# Altium project MAR_modems_board_A1.PrjPcb (part 2 of 2)

## Sheet USB2514_hubs_1.SchDoc
size A3
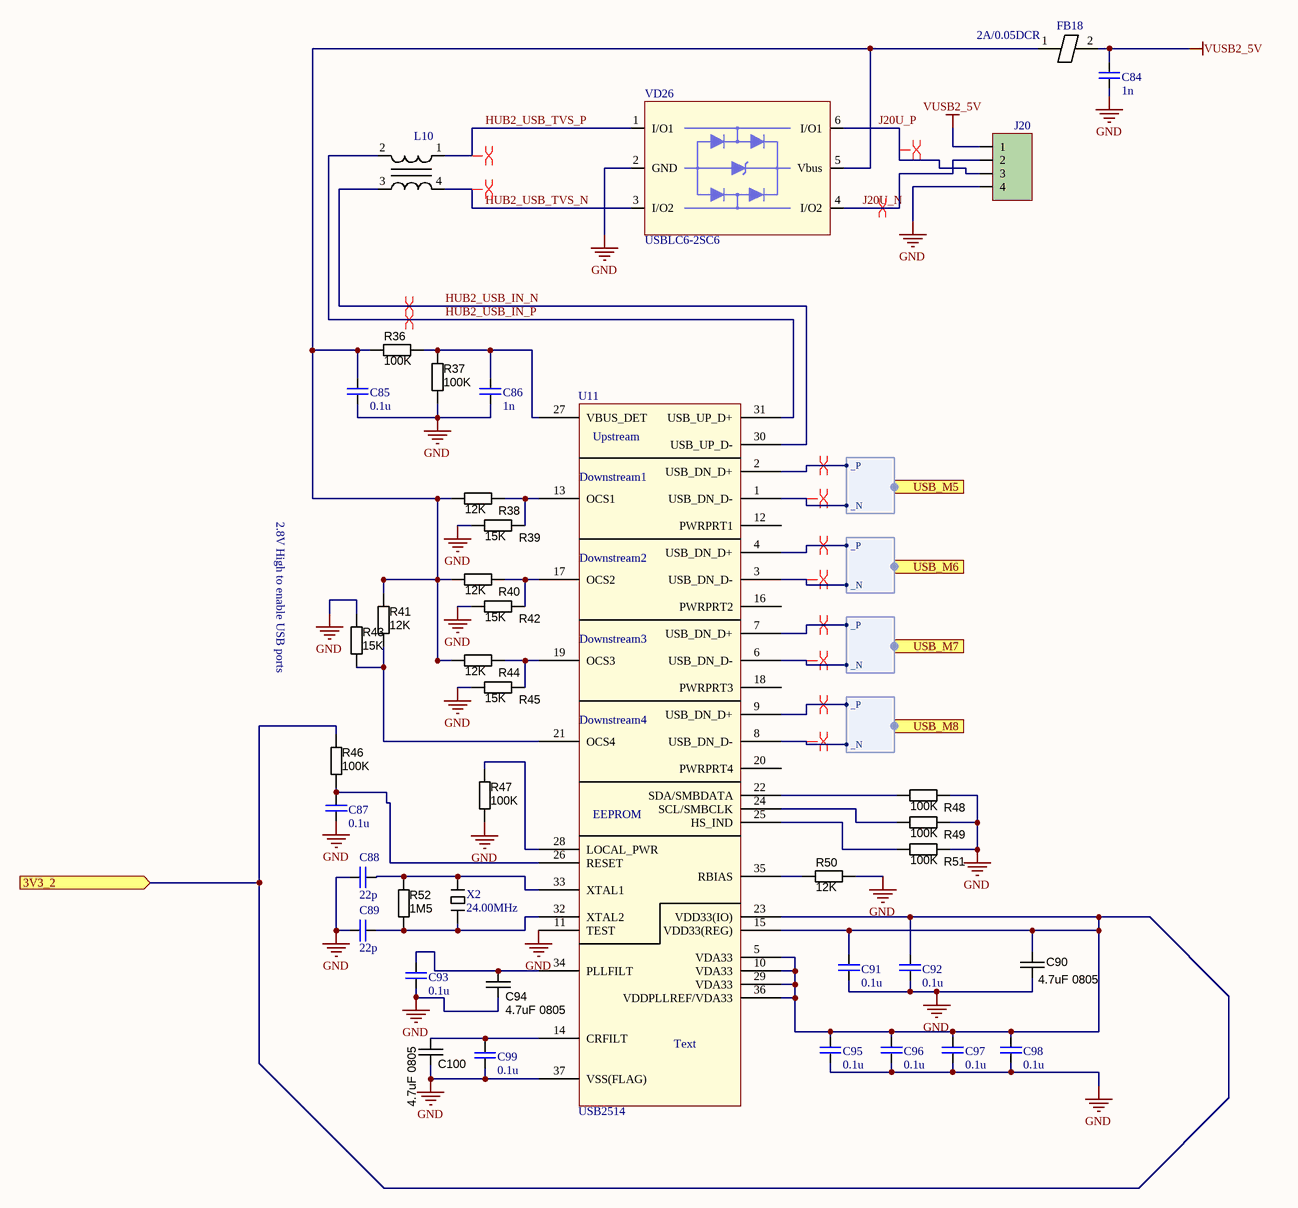
[diagram p6: USB2514_hubs_1.SchDoc]

### Parts
C84  value 1n  [C0402]  (hidden comment: Конденсатор SMD, 1нФ, X7R, 25В, 10%, 0402)
C85  value 0.1u  [C0402]  (hidden comment: Конденсатор SMD, 0.1мкФ, X7R, 25В, 10%, 0402)
C86  value 1n  [C0402]  (hidden comment: Конденсатор SMD, 1нФ, X7R, 25В, 10%, 0402)
C87  value 0.1u  [C0402]  (hidden comment: Конденсатор SMD, 0.1мкФ, X7R, 25В, 10%, 0402)
C88  value 22p  [C0402]  (hidden comment: Конденсатор SMD, 22пФ, X7R, 50В, 10%, 0402)
C89  value 22p  [C0402]  (hidden comment: Конденсатор SMD, 22пФ, X7R, 50В, 10%, 0402)
C90  value 4.7uF 0805  [CAPC2012X135N]  (hidden comment: approved sub OK)
C91  value 0.1u  [C0402]  (hidden comment: Конденсатор SMD, 0.1мкФ, X7R, 25В, 10%, 0402)
C92  value 0.1u  [C0402]  (hidden comment: Конденсатор SMD, 0.1мкФ, X7R, 25В, 10%, 0402)
C93  value 0.1u  [C0402]  (hidden comment: Конденсатор SMD, 0.1мкФ, X7R, 25В, 10%, 0402)
C94  value 4.7uF 0805  [CAPC2012X135N]  (hidden comment: approved sub OK)
C95  value 0.1u  [C0402]  (hidden comment: Конденсатор SMD, 0.1мкФ, X7R, 25В, 10%, 0402)
C96  value 0.1u  [C0402]  (hidden comment: Конденсатор SMD, 0.1мкФ, X7R, 25В, 10%, 0402)
C97  value 0.1u  [C0402]  (hidden comment: Конденсатор SMD, 0.1мкФ, X7R, 25В, 10%, 0402)
C98  value 0.1u  [C0402]  (hidden comment: Конденсатор SMD, 0.1мкФ, X7R, 25В, 10%, 0402)
C99  value 0.1u  [C0402]  (hidden comment: Конденсатор SMD, 0.1мкФ, X7R, 25В, 10%, 0402)
C100  value 4.7uF 0805  [CAPC2012X135N]  (hidden comment: approved sub OK)
FB18  2A/0.05DCR  [RESC2012X70N]
J20  Разъём (вилка), CWF-4 (DS1069-4 M)  [CWF-4]  (value not drawn)
L10  Inductor ESD (Choke)  [EMI Choke Murata]  (value not drawn)
R36  value 100K  [RESC1005X40N]  (hidden comment: Thick Film)
R37  value 100K  [RESC1005X40N]  (hidden comment: Thick Film)
R38  value 12K  [RESC1005X40N]  (hidden comment: Thick Film)
R39  value 15K  [RESC1005X40N]  (hidden comment: Thick Film)
R40  value 12K  [RESC1005X40N]  (hidden comment: Thick Film)
R41  value 12K  [RESC1005X40N]  (hidden comment: Thick Film)
R42  value 15K  [RESC1005X40N]  (hidden comment: Thick Film)
R43  value 15K  [RESC1005X40N]  (hidden comment: Thick Film)
R44  value 12K  [RESC1005X40N]  (hidden comment: Thick Film)
R45  value 15K  [RESC1005X40N]  (hidden comment: Thick Film)
R46  value 100K  [RESC1005X40N]  (hidden comment: Thick Film)
R47  value 100K  [RESC1005X40N]  (hidden comment: Thick Film)
R48  value 100K  [RESC1005X40N]  (hidden comment: Thick Film)
R49  value 100K  [RESC1005X40N]  (hidden comment: Thick Film)
R50  value 12K  [RESC1005X40N]  (hidden comment: Thick Film)
R51  value 100K  [RESC1005X40N]  (hidden comment: Thick Film)
R52  value 1M5  [RESC1005X40N]  (hidden comment: Thick Film)
U11  USB2514  [USB-2514B 4port Hub]
VD26  TVS Diode  [SOT23-6L]  (value not drawn)
X2  24.00MHz  [Quartz SMD KX-K]

### Ports
3V3_2 (in), USB_M5 (harness DIFF), USB_M6 (harness DIFF), USB_M7 (harness DIFF), USB_M8 (harness DIFF)

### Harnesses
DIFF: _P, _N

### Nets
GND: C84.2 C85.2 C86.2 C87.2 C88.1 C89.1 C90.2 C91.2 C92.2 C93.2 C94.2 C95.2 C96.2 C97.2 C98.2 C99.2 C100.2 J20.4 R37.2 R39.1 R42.1 R43.1 R45.1 R47.2 R48.2 R49.2 R50.2 R51.2 U11.11(TEST) U11.37(VSS(FLAG)) VD26.2(GND)
VUSB2_5V: C84.1 FB18.2 J20.1
3V3_2: C90.1 C91.1 C92.1 C95.1 C96.1 C97.1 C98.1 R46.1 U11.5(VDA33) U11.10(VDA33) U11.15(VDD33(REG)) U11.23(VDD33(IO)) U11.29(VDA33) U11.36(VDDPLLREF/VDA33) ; port 3V3_2
HUB2_USB_IN_N: L10.3 U11.30(USB_UP_D-)
HUB2_USB_IN_P: L10.2 U11.31(USB_UP_D+)
HUB2_USB_TVS_N: L10.4 VD26.3(I/O2)
HUB2_USB_TVS_P: L10.1 VD26.1(I/O1)
J20U_N: J20.2 VD26.4(I/O2)
J20U_P: J20.3 VD26.6(I/O1)
USB_M5._N: U11.1(USB_DN_D-) ; port USB_M5._N
USB_M5._P: U11.2(USB_DN_D+) ; port USB_M5._P
USB_M6._N: U11.3(USB_DN_D-) ; port USB_M6._N
USB_M6._P: U11.4(USB_DN_D+) ; port USB_M6._P
USB_M7._N: U11.6(USB_DN_D-) ; port USB_M7._N
USB_M7._P: U11.7(USB_DN_D+) ; port USB_M7._P
USB_M8._N: U11.8(USB_DN_D-) ; port USB_M8._N
USB_M8._P: U11.9(USB_DN_D+) ; port USB_M8._P
NetC85_1: C85.1 FB18.1 R36.1 R38.1 R40.1 R41.1 R44.1 VD26.5(Vbus)
NetC86_1: C86.1 R36.2 R37.1 U11.27(VBUS_DET)
NetC87_1: C87.1 R46.2 U11.26(RESET)
NetC88_2: C88.2 R52.1 U11.33(XTAL1) X2.2
NetC89_2: C89.2 R52.2 U11.32(XTAL2) X2.1
NetC93_1: C93.1 C94.1 U11.34(PLLFILT)
NetC99_1: C99.1 C100.1 U11.14(CRFILT)
NetR38_2: R38.2 R39.2 U11.13(OCS1)
NetR40_2: R40.2 R42.2 U11.17(OCS2)
NetR41_2: R41.2 R43.2 U11.21(OCS4)
NetR44_2: R44.2 R45.2 U11.19(OCS3)
NetR47_1: R47.1 U11.28(LOCAL_PWR)
NetR48_1: R48.1 U11.22(SDA/SMBDATA)
NetR49_1: R49.1 U11.24(SCL/SMBCLK)
NetR50_1: R50.1 U11.35(RBIAS)
NetR51_1: R51.1 U11.25(HS_IND)

Not connected (* = marked no-connect by the designer): U11 12(PWRPRT1) 16(PWRPRT2) 18(PWRPRT3) 20(PWRPRT4)

### Layout directives
differential pair: HUB2_USB_IN_N, HUB2_USB_IN_P, HUB2_USB_TVS_N, HUB2_USB_TVS_P, J20U_N, J20U_P, USB_M5._N, USB_M5._P, USB_M6._N, USB_M6._P, USB_M7._N, USB_M7._P, USB_M8._N, USB_M8._P

### Notes on the sheet
- 2.8V High to enable USB ports
- (in symbol SMSC USB2514) Upstream; Downstream1; Downstream2; Downstream3; Downstream4; EEPROM; Text

### Library data of the parts
C84 C86 = C0402: Chip Capacitor 0402; Assembly: 1n_X7R_25V_10%_0402; Voltage_assembly: 25V; Tolerance: 10%; Voltage: 25В; TemperatureCoeff: X7R; Family: Конденсатор SMD; Capacitance: 1нФ; Package: 0402
C85 C87 C91-C93 C95-C99 = C0402: Chip Capacitor 0402; Assembly: 0.1u_X7R_25V_10%_0402; Voltage_assembly: 25V; Tolerance: 10%; Voltage: 25В; TemperatureCoeff: X7R; Family: Конденсатор SMD; Capacitance: 0.1мкФ; Package: 0402
C88 C89 = C0402: Chip Capacitor 0402; Assembly: 22p_X7R_50V_10%_0402; Voltage_assembly: 50V; Tolerance: 10%; Voltage: 50В; TemperatureCoeff: X7R; Family: Конденсатор SMD; Capacitance: 22пФ; Package: 0402
C90 C94 C100 = CAPC_4u7_0805: Capacitor SMD Cer 4.7uF 10% 16V X5R 0805; Manufacturer 1: Taiyo Yuden; Manufacturer Part Number 1: EMK212BJ475KG-T; Ratings: 16V; X5R; Material: ceramic; SCDType: spec; Package / Case: 0805 (2012 Metric); Tolerance: ±10%; Supplier 1: Digi-Key; Supplier Part Number 1: 587-1294-1-ND; Operating Temperature: -55°C ~ 85°C; Size / Dimension: 0.079" L x 0.049" W (2.00mm x 1.25mm); Thickness (Max): 0.053" (1.35mm); ComponentLink1URL: http://www.yuden.co.jp/productdata/catalog/en/mlcc01_e.pdf; ComponentLink1Description: http://www.yuden.co.jp/productdata/catalog/en/mlcc01_e.pdf; Supplier 2: Digi-Key; Supplier Part Number 2: 1276-1065-1-ND; Manufacturer 2: Samsung Electro-Mechanics America, Inc; Manufacturer Part Number 2: CL21A475KOFNNNE; RoHS 2: RoHS Compliant; ComponentLink2URL: http://www.samsungsem.com/servlet/FileDownload?type=spec&file=CL21A475KOFNNNE.pdf; ComponentLink2Description: http://www.samsungsem.com/servlet/FileDownload?type=spec&file=CL21A475KOFNNNE.pdf; Supplier 3: Digi-Key; Supplier Part Number 3: 399-8101-1-ND; Manufacturer 3: Kemet; Manufacturer Part Number 3: C0805C475K4PACTU; RoHS 3: RoHS Compliant; ComponentLink3URL: http://capacitoredge.kemet.com/capedge2/DataSheet?pn=C0805C475K4PACTU; ComponentLink3Description: http://capacitoredge.kemet.com/capedge2/DataSheet?pn=C0805C475K4PACTU; Supplier 4: Digi-Key; Supplier Part Number 4: 490-7215-1-ND; Manufacturer 4: Murata Electronics North America; Manufacturer Part Number 4: GRM21BR61C475MA88L; RoHS 4: RoHS Compliant; ComponentLink4URL: http://psearch.murata.com/capacitor/product/GRM21BR61C475MA88#.pdf; ComponentLink4Description: http://psearch.murata.com/capacitor/product/GRM21BR61C475MA88#.pdf; Supplier 5: Digi-Key; Supplier Part Number 5: 445-7640-1-ND; Manufacturer 5: TDK Corporation; Manufacturer Part Number 5: C2012X5R1C475K125AC; RoHS 5: RoHS Compliant; ComponentLink5URL: http://product.tdk.com/capacitor/mlcc/en/documents/mlcc_commercial_general_en.pdf; ComponentLink5Description: http://product.tdk.com/capacitor/mlcc/en/documents/mlcc_commercial_general_en.pdf; RoHS 1: RoHS Compliant
FB18 = Ferrite Bead 2A/0.05DCR
J20 = CWF-4: 4-pin male though-hole connector, pitch 2.5 mm; Manufacturer: Confly (China); Family: Разъём (вилка); PartNumber: CWF-4 (DS1069-4 M); Assembly: CWF-4; Value: CWF-4
L10 = Inductor ESD (Choke): DLW21HN900SQ2L
R36 R37 R46 R47 = RES_100K_0402_5%: Resistor SMD chip 100k Ohm 0.063W 5% 0402; Manufacturer 1: Vishay Dale; Manufacturer Part Number 1: CRCW0402100KJNED; Ratings: 1/16 W; SCDType: undef; Package / Case: 0402 (1005 Metric); Tolerance: ±5%; ComponentLink2URL: http://www.yageo.com/documents/recent/PYu-RC0402_51_RoHS_L_6.pdf; ComponentLink2Description: http://www.yageo.com/documents/recent/PYu-RC0402_51_RoHS_L_6.pdf; Supplier 1: Digi-Key; Supplier Part Number 1: 541-100KJCT-ND; ComponentLink1URL: http://www.vishay.com/doc?20035; ComponentLink1Description: http://www.vishay.com/doc?20035; Supplier 2: Digi-Key; Supplier Part Number 2: 311-100KJRCT-ND; Manufacturer 2: Yageo; Manufacturer Part Number 2: RC0402JR-07100KL
R38-R45 R48-R51 = RES_1K_0402_5%: Resistor SMD chip 1k Ohm 0.063W 5% 0402; Manufacturer 1: Yageo; Manufacturer Part Number 1: RC0402JR-071KL; Ratings: 1/16 W; SCDType: spec; Package / Case: 0402 (1005 Metric); Tolerance: ±5%; Supplier 1: Digi-Key; Supplier Part Number 1: 311-1.0KJRCT-ND; RoHS 1: RoHS Compliant; ComponentLink1URL: http://www.yageo.com/documents/recent/PYu-RC0402_51_RoHS_L_6.pdf; ComponentLink1Description: http://www.yageo.com/documents/recent/PYu-RC0402_51_RoHS_L_6.pdf; Supplier 2: Digi-Key; Supplier Part Number 2: 541-1.0KJCT-ND; Manufacturer 2: Vishay Dale; Manufacturer Part Number 2: CRCW04021K00JNED; RoHS 2: RoHS Compliant; ComponentLink2URL: http://www.vishay.com/doc?20035; ComponentLink2Description: http://www.vishay.com/doc?20035; Supplier 3: Digi-Key; Supplier Part Number 3: 1276-4376-1-ND; Manufacturer 3: Samsung Electro-Mechanics America, Inc; Manufacturer Part Number 3: RC1005J102CS; RoHS 3: RoHS Compliant; ComponentLink3URL: http://www.samsungsem.com/servlet/FileDownload?filename=productcatalog/pdf/Chip_Resistor.pdf; ComponentLink3Description: http://www.samsungsem.com/servlet/FileDownload?filename=productcatalog/pdf/Chip_Resistor.pdf; Supplier 4: Digi-Key; Supplier Part Number 4: RHM1.0KCECT-ND; Manufacturer 4: Rohm Semiconductor; Manufacturer Part Number 4: MCR01MRTJ102; RoHS 4: RoHS Compliant; ComponentLink4URL: http://rohmfs.rohm.com/en/products/databook/datasheet/passive/resistor/chip_resistor/mcr_g.pdf; ComponentLink4Description: http://rohmfs.rohm.com/en/products/databook/datasheet/passive/resistor/chip_resistor/mcr_g.pdf; Supplier 5: Digi-Key; Supplier Part Number 5: P1.0KJCT-ND; Manufacturer 5: Panasonic Electronic Components; Manufacturer Part Number 5: ERJ-2GEJ102X; RoHS 5: RoHS Compliant; ComponentLink5URL: http://industrial.panasonic.com/www-cgi/jvcr13pz.cgi?E+PZ+3+AOA0001+ERJ2GEJ102X+7+WW; ComponentLink5Description: http://industrial.panasonic.com/www-cgi/jvcr13pz.cgi?E+PZ+3+AOA0001+ERJ2GEJ102X+7+WW
R52 = RES_1M_0402_5%: Resistor SMD chip 1M Ohm 0.063W 5% 0402; Manufacturer 1: Vishay Dale; Manufacturer Part Number 1: CRCW04021M00JNED; Ratings: 1/16 W; Power Rating: 0.063W, 1/16W; SCDType: spec; Package / Case: 0402 (1005 Metric); Tolerance: ±5%; Material: Thick Film; Manufacturer 2: Yageo; Manufacturer Part Number 2: RC0402JR-071ML; Supplier 1: Digi-Key; Supplier Part Number 1: 541-1.0MJCT-ND; ComponentLink1URL: http://www.vishay.com/doc?20035; ComponentLink1Description: http://www.vishay.com/doc?20035; Supplier 2: Digi-Key; Supplier Part Number 2: 311-1.0MJRCT-ND; ComponentLink2URL: http://www.yageo.com/documents/recent/PYu-RC0402_51_RoHS_L_6.pdf; ComponentLink2Description: http://www.yageo.com/documents/recent/PYu-RC0402_51_RoHS_L_6.pdf
U11 = SMSC USB2514: type: USB2514
VD26 = USBLC6-2SC6: Very low capacitance ESD protection; Manufacturer: STMicroelectronics; Part Number: USBLC6-2SC6
X2 = Quartz: Quartz KX-K

## Sheet 12Vin_to_3V3_LDO.SchDoc
size A4
Used 2 times, as channels 1, 2. Parts and nets are listed once, with the designators drawn on the sheet.
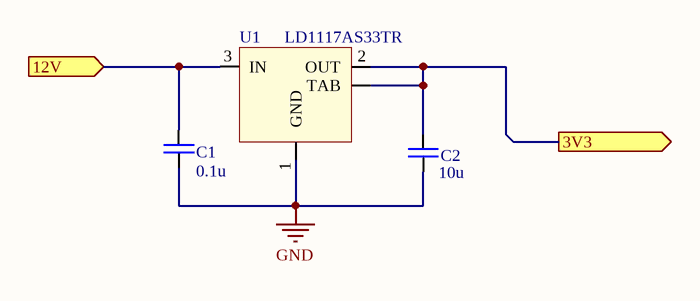
[diagram p7: 12Vin_to_3V3_LDO.SchDoc]

### Parts
C1  value 0.1u  [C0402]  (hidden comment: Конденсатор SMD, 0.1мкФ, X7R, 25В, 10%, 0402)
C2  value 10u  [C0805]  (hidden comment: Конденсатор SMD, 10мкФ, X7R, 16В, 10%, 0805)
U1  Микросхема, LD1117AS33TR  [SOT223]  (value not drawn)

### Ports
3V3 (out), 12V (in)

### Nets
GND: C1.2 C2.2 U1.1(GND)
3V3: C2.1 U1.2(OUT) U1.4(TAB) ; port 3V3
12V: C1.1 U1.3(IN) ; port 12V

### Channels
1: designators end in _1; ports 3V3=3V3_1 12V=VCC_12V
2: designators end in _2; ports 3V3=3V3_2 12V=VCC_12V

### Library data of the parts
C1 = C0402: as C85 on sheet USB2514_hubs_1; Voltage: 25В; Tolerance: 10%; TemperatureCoeff: X7R; Family: Конденсатор SMD; Capacitance: 0.1мкФ; Package: 0402
C2 = C0805: Chip Capacitor 0805; Assembly: 10u_X7R_16V_10%_0805; Voltage_assembly: 16V; Voltage: 16В; Tolerance: 10%; TemperatureCoeff: X7R; Family: Конденсатор SMD; Package: 0805; Capacitance: 10мкФ
U1 = LD1117AS33TR: 0.8-A, Positive Fixed-Voltage, Low-Dropout Regulator; Manufacturer: ST Microelectronics; Family: Микросхема; Package: SOT223; Assembly: LD1117AS33TR; PartNumber: LD1117AS33TR

## Sheet Arduino_CTRL.SchDoc
size A4
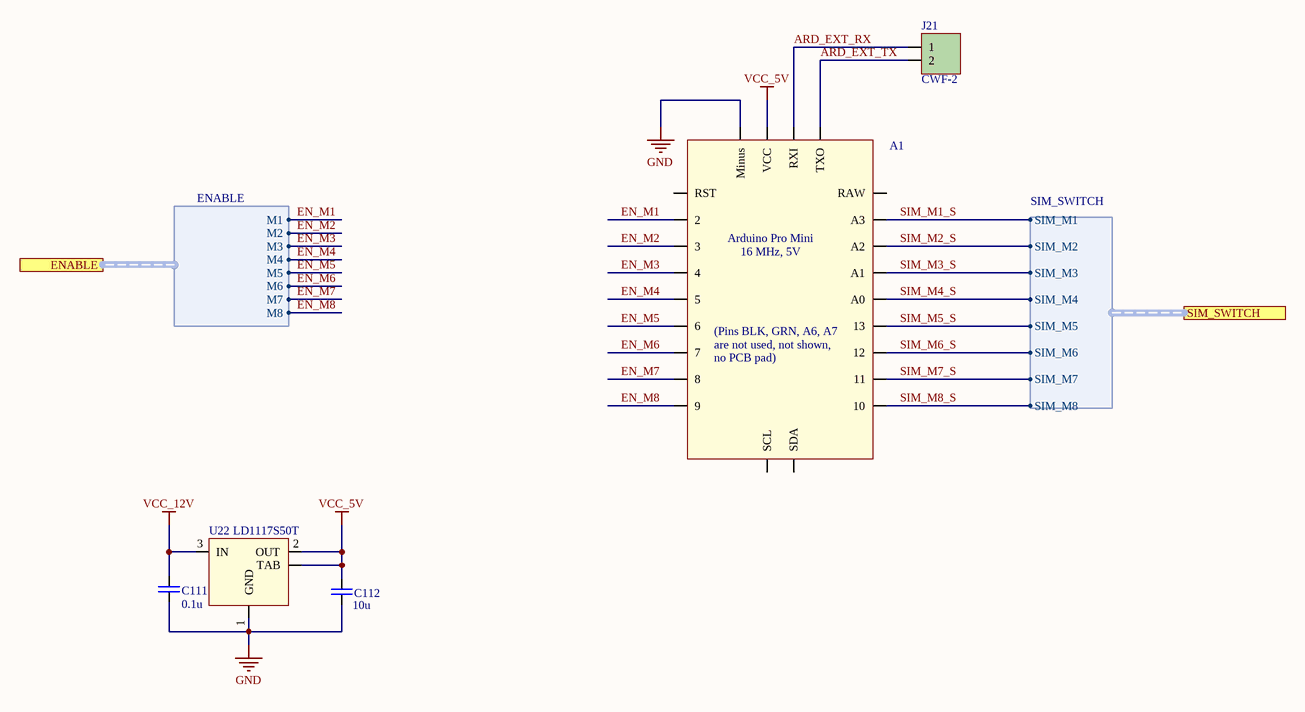
[diagram p8: Arduino_CTRL.SchDoc]

### Parts
A1  Интегрированный модуль Arduino Pro Mini, 16 МГц, 5В PBS-12 (DS1023-1x12)(x2) PBS-4 (DS1023-1x4)PartNumber3  [Arduino Pro Mini Reduced]  (value not drawn)
C111  value 0.1u  [C0402]  (hidden comment: Конденсатор SMD, 0.1мкФ, X7R, 25В, 10%, 0402)
C112  value 10u  [C0805]  (hidden comment: Конденсатор SMD, 10мкФ, X7R, 16В, 10%, 0805)
J21  value CWF-2  [CWF-2]  (hidden comment: Разъём (вилка), CWF-2 (DS1069-2 M))
U22  PartNumber: LD1117S50T  [SOT223]  (hidden comment: Микросхема, LD1117S50T)

### Ports
ENABLE (harness ENABLE), SIM_SWITCH (harness SIM_SWITCH)

### Harnesses
ENABLE: M1, M2, M3, M4, M5, M6, M7, M8
SIM_SWITCH: SIM_M1, SIM_M2, SIM_M3, SIM_M4, SIM_M5, SIM_M6, SIM_M7, SIM_M8

### Nets
GND: A1.Minus C111.2 C112.2 U22.1(GND)
VCC_5V: A1.VCC C112.1 U22.2(OUT) U22.4(TAB)
VCC_12V: C111.1 U22.3(IN)
ARD_EXT_RX: A1.RXI J21.1
ARD_EXT_TX: A1.TXO J21.2
EN_M1: A1.2 ; port ENABLE.M1
EN_M2: A1.3 ; port ENABLE.M2
EN_M3: A1.4 ; port ENABLE.M3
EN_M4: A1.5 ; port ENABLE.M4
EN_M5: A1.6 ; port ENABLE.M5
EN_M6: A1.7 ; port ENABLE.M6
EN_M7: A1.8 ; port ENABLE.M7
EN_M8: A1.9 ; port ENABLE.M8
SIM_M1_S: A1.A3 ; port SIM_SWITCH.SIM_M1
SIM_M2_S: A1.A2 ; port SIM_SWITCH.SIM_M2
SIM_M3_S: A1.A1 ; port SIM_SWITCH.SIM_M3
SIM_M4_S: A1.A0 ; port SIM_SWITCH.SIM_M4
SIM_M5_S: A1.13 ; port SIM_SWITCH.SIM_M5
SIM_M6_S: A1.12 ; port SIM_SWITCH.SIM_M6
SIM_M7_S: A1.11 ; port SIM_SWITCH.SIM_M7
SIM_M8_S: A1.10 ; port SIM_SWITCH.SIM_M8

Not connected (* = marked no-connect by the designer): A1 A4(SDA) A5(SCL) RAW RST

### Notes on the sheet
- (in symbol Arduino Pro Mini 16MHz 5v Reduced) Arduino Pro Mini; 16 MHz, 5V; (Pins BLK, GRN, A6, A7; are not used, not shown,; no PCB pad)

### Library data of the parts
A1 = Arduino Pro Mini 16MHz 5v Reduced: Arduino Pro Mini 16MHz 5v; Family: Интегрированный модуль Arduino Pro Mini, 16 МГц, 5В; PartNumber1: PBS-12 (DS1023-1x12); PartNumber2: PBS-4 (DS1023-1x4); PartNumber3: PBS-2 (DS1023-1x2)
C111 = C0402: as C85 on sheet USB2514_hubs_1; Voltage: 25В; Tolerance: 10%; TemperatureCoeff: X7R; Family: Конденсатор SMD; Capacitance: 0.1мкФ; Package: 0402
C112 = C0805: as C2 on sheet 12Vin_to_3V3_LDO; Voltage: 16В; Tolerance: 10%; TemperatureCoeff: X7R; Family: Конденсатор SMD; Package: 0805; Capacitance: 10мкФ
J21 = CWF-2: Manufacturer: (China); Family: Разъём (вилка); PartNumber: CWF-2 (DS1069-2 M); Assembly: CWF-2
U22 = LD1117S50TR: 0.8-A, Positive Fixed-Voltage, Low-Dropout Regulator; Manufacturer: ST Microelectronics; Family: Микросхема; Package: SOT223; Assembly: LD1117S50T

## Sheet Multiplexers.SchDoc
size A3
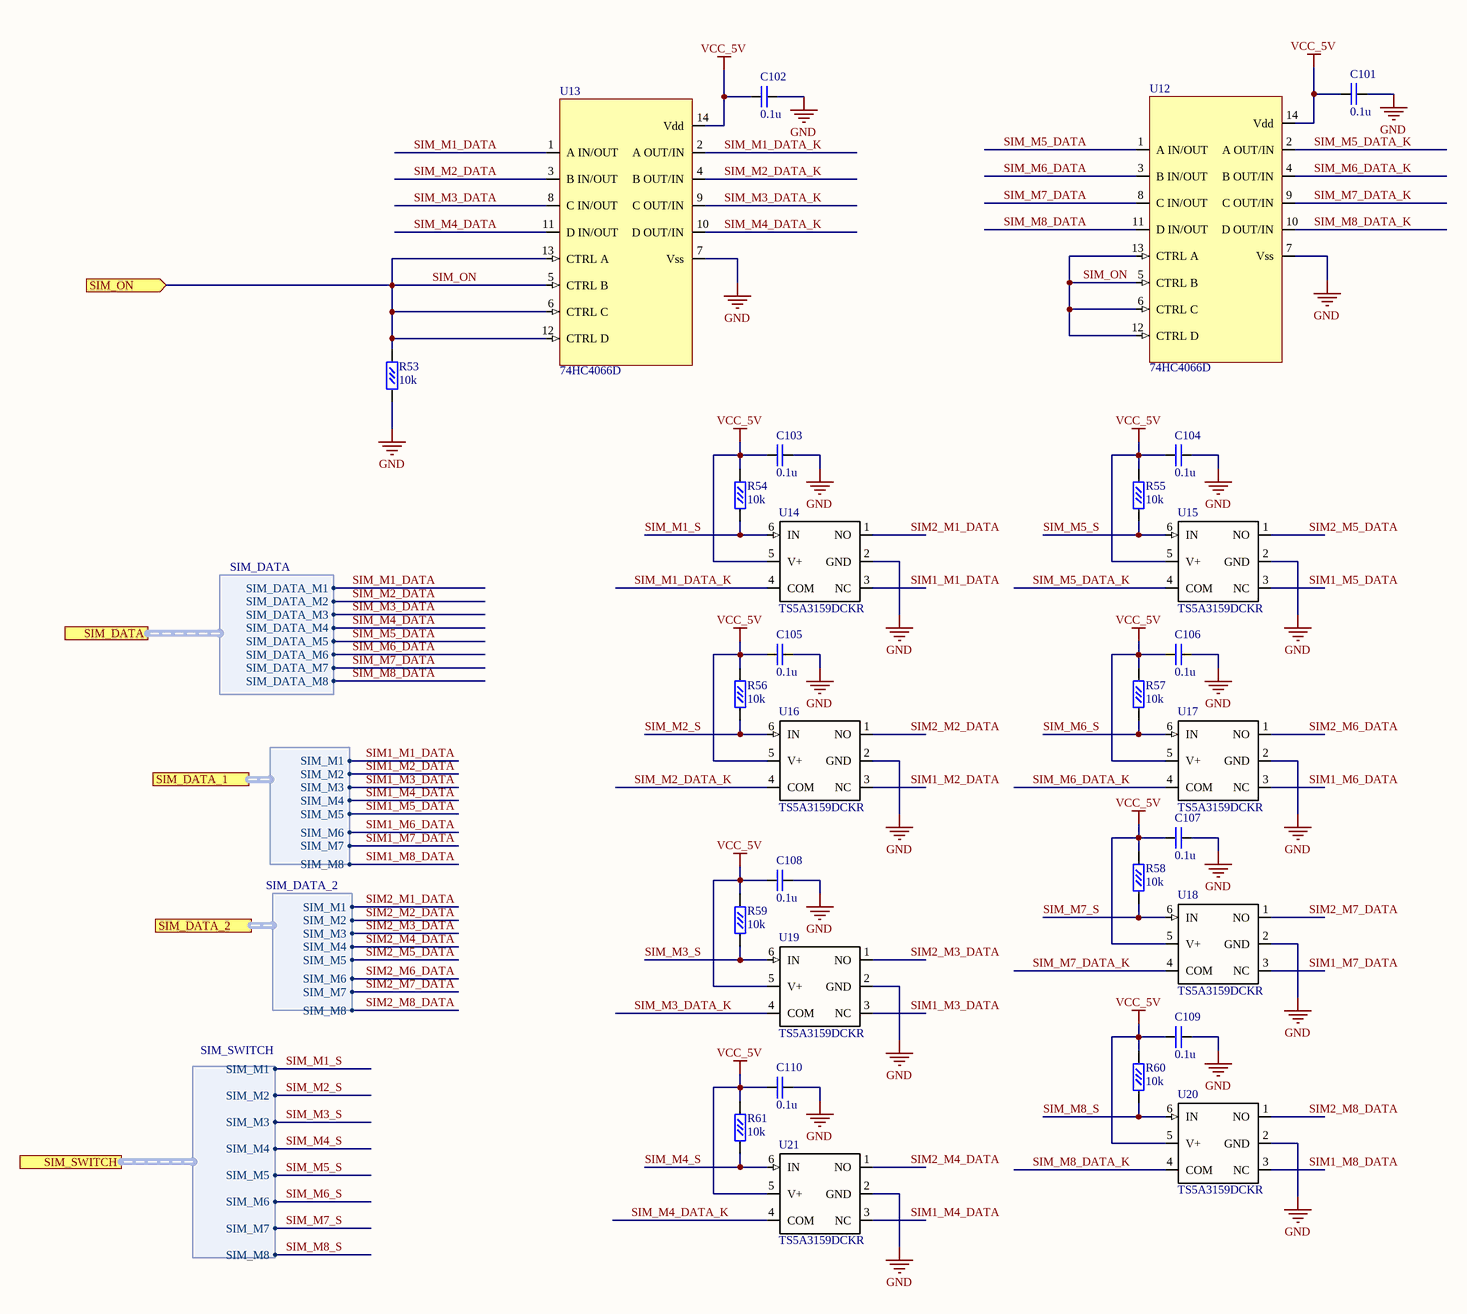
[diagram p9: Multiplexers.SchDoc]

### Parts
C101  value 0.1u  [C0402]  (hidden comment: Конденсатор SMD, 0.1мкФ, X7R, 16В, 10%, 0402)
C102  value 0.1u  [C0402]  (hidden comment: Конденсатор SMD, 0.1мкФ, X7R, 16В, 10%, 0402)
C103  value 0.1u  [C0402]  (hidden comment: Конденсатор SMD, 0.1мкФ, X5R, 25В, 10%, 0402)
C104  value 0.1u  [C0402]  (hidden comment: Конденсатор SMD, 0.1мкФ, X5R, 25В, 10%, 0402)
C105  value 0.1u  [C0402]  (hidden comment: Конденсатор SMD, 0.1мкФ, X5R, 25В, 10%, 0402)
C106  value 0.1u  [C0402]  (hidden comment: Конденсатор SMD, 0.1мкФ, X5R, 25В, 10%, 0402)
C107  value 0.1u  [C0402]  (hidden comment: Конденсатор SMD, 0.1мкФ, X5R, 25В, 10%, 0402)
C108  value 0.1u  [C0402]  (hidden comment: Конденсатор SMD, 0.1мкФ, X5R, 25В, 10%, 0402)
C109  value 0.1u  [C0402]  (hidden comment: Конденсатор SMD, 0.1мкФ, X5R, 25В, 10%, 0402)
C110  value 0.1u  [C0402]  (hidden comment: Конденсатор SMD, 0.1мкФ, X5R, 25В, 10%, 0402)
R53  value 10k  [R0603]  (hidden comment: Резистор SMD, 0.1Вт, 0603, 10кОм, 1%)
R54  value 10k  [R0603]  (hidden comment: Резистор SMD, 0.1Вт, 0603, 10кОм, 1%)
R55  value 10k  [R0603]  (hidden comment: Резистор SMD, 0.1Вт, 0603, 10кОм, 1%)
R56  value 10k  [R0603]  (hidden comment: Резистор SMD, 0.1Вт, 0603, 10кОм, 1%)
R57  value 10k  [R0603]  (hidden comment: Резистор SMD, 0.1Вт, 0603, 10кОм, 1%)
R58  value 10k  [R0603]  (hidden comment: Резистор SMD, 0.1Вт, 0603, 10кОм, 1%)
R59  value 10k  [R0603]  (hidden comment: Резистор SMD, 0.1Вт, 0603, 10кОм, 1%)
R60  value 10k  [R0603]  (hidden comment: Резистор SMD, 0.1Вт, 0603, 10кОм, 1%)
R61  value 10k  [R0603]  (hidden comment: Резистор SMD, 0.1Вт, 0603, 10кОм, 1%)
U12  74HC4066D  [14-SOIC]
U13  74HC4066D  [14-SOIC]
U14  PartNumber: TS5A3159DCKR  [SC70-6]  (hidden comment: TS5A3159)
U15  PartNumber: TS5A3159DCKR  [SC70-6]  (hidden comment: TS5A3159)
U16  PartNumber: TS5A3159DCKR  [SC70-6]  (hidden comment: TS5A3159)
U17  PartNumber: TS5A3159DCKR  [SC70-6]  (hidden comment: TS5A3159)
U18  PartNumber: TS5A3159DCKR  [SC70-6]  (hidden comment: TS5A3159)
U19  PartNumber: TS5A3159DCKR  [SC70-6]  (hidden comment: TS5A3159)
U20  PartNumber: TS5A3159DCKR  [SC70-6]  (hidden comment: TS5A3159)
U21  PartNumber: TS5A3159DCKR  [SC70-6]  (hidden comment: TS5A3159)

### Ports
SIM_DATA (harness SIM_DATA), SIM_DATA_1 (harness SIM_DATA_1), SIM_DATA_2 (harness SIM_DATA_2), SIM_ON (in), SIM_SWITCH (harness SIM_SWITCH)

### Harnesses
SIM_DATA: SIM_DATA_M1, SIM_DATA_M2, SIM_DATA_M3, SIM_DATA_M4, SIM_DATA_M5, SIM_DATA_M6, SIM_DATA_M7, SIM_DATA_M8
SIM_SWITCH: SIM_M1, SIM_M2, SIM_M3, SIM_M4, SIM_M5, SIM_M6, SIM_M7, SIM_M8
SIM_DATA_2: SIM_M1, SIM_M2, SIM_M3, SIM_M4, SIM_M5, SIM_M6, SIM_M7, SIM_M8
SIM_DATA_1: SIM_M1, SIM_M2, SIM_M3, SIM_M4, SIM_M5, SIM_M6, SIM_M7, SIM_M8

### Nets
GND: C101.2 C102.2 C103.2 C104.2 C105.2 C106.2 C107.2 C108.2 C109.2 C110.2 R53.1 U12.7(Vss) U13.7(Vss) U14.2(GND) U15.2(GND) U16.2(GND) U17.2(GND) U18.2(GND) U19.2(GND) U20.2(GND) U21.2(GND)
VCC_5V: C101.1 C102.1 C103.1 C104.1 C105.1 C106.1 C107.1 C108.1 C109.1 C110.1 R54.2 R55.2 R56.2 R57.2 R58.2 R59.2 R60.2 R61.2 U12.14(Vdd) U13.14(Vdd) U14.5(V+) U15.5(V+) U16.5(V+) U17.5(V+) U18.5(V+) U19.5(V+) U20.5(V+) U21.5(V+)
SIM1_M1_DATA: U14.3(NC) ; port SIM_DATA_1.SIM_M1
SIM1_M2_DATA: U16.3(NC) ; port SIM_DATA_1.SIM_M2
SIM1_M3_DATA: U19.3(NC) ; port SIM_DATA_1.SIM_M3
SIM1_M4_DATA: U21.3(NC) ; port SIM_DATA_1.SIM_M4
SIM1_M5_DATA: U15.3(NC) ; port SIM_DATA_1.SIM_M5
SIM1_M6_DATA: U17.3(NC) ; port SIM_DATA_1.SIM_M6
SIM1_M7_DATA: U18.3(NC) ; port SIM_DATA_1.SIM_M7
SIM1_M8_DATA: U20.3(NC) ; port SIM_DATA_1.SIM_M8
SIM2_M1_DATA: U14.1(NO) ; port SIM_DATA_2.SIM_M1
SIM2_M2_DATA: U16.1(NO) ; port SIM_DATA_2.SIM_M2
SIM2_M3_DATA: U19.1(NO) ; port SIM_DATA_2.SIM_M3
SIM2_M4_DATA: U21.1(NO) ; port SIM_DATA_2.SIM_M4
SIM2_M5_DATA: U15.1(NO) ; port SIM_DATA_2.SIM_M5
SIM2_M6_DATA: U17.1(NO) ; port SIM_DATA_2.SIM_M6
SIM2_M7_DATA: U18.1(NO) ; port SIM_DATA_2.SIM_M7
SIM2_M8_DATA: U20.1(NO) ; port SIM_DATA_2.SIM_M8
SIM_M1_DATA: U13.1(A_IN/OUT) ; port SIM_DATA.SIM_DATA_M1  [project net SD_M1]
SIM_M1_DATA_K: U13.2(A_OUT/IN) U14.4(COM)
SIM_M1_S: R54.1 U14.6(IN) ; port SIM_SWITCH.SIM_M1
SIM_M2_DATA: U13.3(B_IN/OUT) ; port SIM_DATA.SIM_DATA_M2  [project net SD_M2]
SIM_M2_DATA_K: U13.4(B_OUT/IN) U16.4(COM)
SIM_M2_S: R56.1 U16.6(IN) ; port SIM_SWITCH.SIM_M2
SIM_M3_DATA: U13.8(C_IN/OUT) ; port SIM_DATA.SIM_DATA_M3  [project net SD_M3]
SIM_M3_DATA_K: U13.9(C_OUT/IN) U19.4(COM)
SIM_M3_S: R59.1 U19.6(IN) ; port SIM_SWITCH.SIM_M3
SIM_M4_DATA: U13.11(D_IN/OUT) ; port SIM_DATA.SIM_DATA_M4  [project net SD_M4]
SIM_M4_DATA_K: U13.10(D_OUT/IN) U21.4(COM)
SIM_M4_S: R61.1 U21.6(IN) ; port SIM_SWITCH.SIM_M4
SIM_M5_DATA: U12.1(A_IN/OUT) ; port SIM_DATA.SIM_DATA_M5  [project net SD_M5]
SIM_M5_DATA_K: U12.2(A_OUT/IN) U15.4(COM)
SIM_M5_S: R55.1 U15.6(IN) ; port SIM_SWITCH.SIM_M5
SIM_M6_DATA: U12.3(B_IN/OUT) ; port SIM_DATA.SIM_DATA_M6  [project net SD_M6]
SIM_M6_DATA_K: U12.4(B_OUT/IN) U17.4(COM)
SIM_M6_S: R57.1 U17.6(IN) ; port SIM_SWITCH.SIM_M6
SIM_M7_DATA: U12.8(C_IN/OUT) ; port SIM_DATA.SIM_DATA_M7  [project net SD_M7]
SIM_M7_DATA_K: U12.9(C_OUT/IN) U18.4(COM)
SIM_M7_S: R58.1 U18.6(IN) ; port SIM_SWITCH.SIM_M7
SIM_M8_DATA: U12.11(D_IN/OUT) ; port SIM_DATA.SIM_DATA_M8  [project net SD_M8]
SIM_M8_DATA_K: U12.10(D_OUT/IN) U20.4(COM)
SIM_M8_S: R60.1 U20.6(IN) ; port SIM_SWITCH.SIM_M8
SIM_ON: R53.2 U12.5(CTRL_B) U12.6(CTRL_C) U12.12(CTRL_D) U12.13(CTRL_A) U13.5(CTRL_B) U13.6(CTRL_C) U13.12(CTRL_D) U13.13(CTRL_A) ; port SIM_ON

### Library data of the parts
C101 C102 = C0402: Chip Capacitor 0402; Assembly: 0.1u_X7R_16V_10%_0402; Voltage_assembly: 16V; Voltage: 16В; Tolerance: 10%; TemperatureCoeff: X7R; Family: Конденсатор SMD; Capacitance: 0.1мкФ; Package: 0402
C103-C110 = C0402: Chip Capacitor 0402; Assembly: 0.1u_X5R_25V_10%_0402; Voltage_assembly: 25V; Voltage: 25В; Tolerance: 10%; TemperatureCoeff: X5R; Family: Конденсатор SMD; Capacitance: 0.1мкФ; Package: 0402
R53-R61 = R0603_0.1: Chip Resistor 0603, 0.1 W; Assembly: 10k_0.1W_1%_0603; Power_assembly: 0.1W; Power: 0.1Вт; Tolerance: 1%; Family: Резистор SMD; Package: 0603; Resistance: 10кОм
U12 U13 = 74HC4066D: CMOS QUAD BILATERAL SWITCH; Manufacturer: Nexperia; Family: Микросхема; Package: SOIC-14; PartNumber: 74HC4066D
U14-U21 = TS5A3159: Analog SPDT Switch; Manufacturer: Texas Instruments; Family: Микросхема; Package: SC70-6

## Sheet ST1Sxx.SchDoc
size A4
Used 8 times, as channels ST1Sxx_1, ST1Sxx_2, ST1Sxx_3, ST1Sxx_4, ST1Sxx_5, ST1Sxx_6, ST1Sxx_7, ST1Sxx_8. Parts and nets are listed once, with the designators drawn on the sheet.
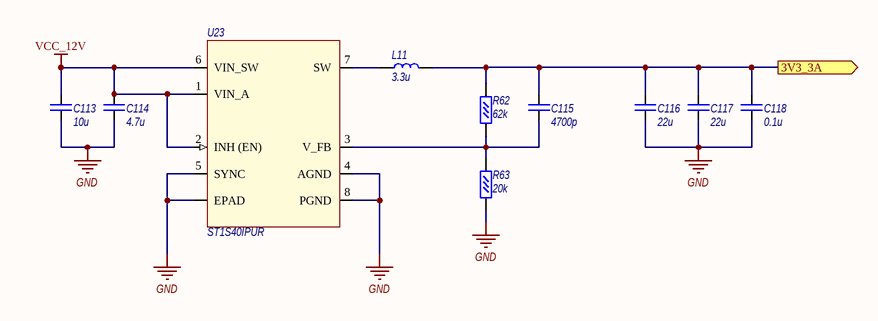
[diagram p10: ST1Sxx.SchDoc]

### Parts
C113  value 10u  [C0805]  (hidden comment: Конденсатор SMD, 10мкФ, X7R, 50В, 10%, 0805)
C114  value 4.7u  [C0805]  (hidden comment: Конденсатор SMD, 4.7мкФ, X7R, 50В, 10%, 0805)
C115  value 4700p  [C0402]  (hidden comment: Конденсатор SMD, 4700p, X7R, 6.3В, 10%, 0402)
C116  value 22u  [C0603]  (hidden comment: Конденсатор SMD, 22мкФ, X7R, 6.3В, 10%, 0603)
C117  value 22u  [C0603]  (hidden comment: Конденсатор SMD, 22мкФ, X7R, 6.3В, 10%, 0603)
C118  value 0.1u  [C0603]  (hidden comment: Конденсатор SMD, 0.1мкФ, X7R, 6.3В, 10%, 0603)
L11  value 3.3u  [SRP4020TA]  (hidden comment: Катушка индуктивности, 3.3мкГн, SRP4020TA-3R3M)
R62  value 62k  [R0402]  (hidden comment: Резистор SMD, 0.063Вт, 0402, 62кОм, 1%)
R63  value 20k  [R0402]  (hidden comment: Резистор SMD, 0.063Вт, 0402, 20кОм, 1%)
U23  PartNumber: ST1S40IPUR  [SON80P400X400X100-9N-D]  (hidden comment: Микросхема, ST1S40IPUR)

### Ports
3V3_3A (out)

### Nets
GND: C113.1 C114.1 C116.1 C117.1 C118.1 R63.1 U23.0(EPAD) U23.4(AGND) U23.5(SYNC) U23.8(PGND)
VCC_12V: C113.2 C114.2 U23.1(VIN_A) U23.2(INH_(EN)) U23.6(VIN_SW)
3V3_3A: C115.2 C116.2 C117.2 C118.2 L11.2 R62.2 ; port 3V3_3A
NetC115_1: C115.1 R62.1 R63.2 U23.3(V_FB)
NetL11_1: L11.1 U23.7(SW)

### Channels
ST1Sxx_1: designators end in _1; ports 3V3_3A=3V3_3A_1
ST1Sxx_2: designators end in _2; ports 3V3_3A=3V3_3A_2
ST1Sxx_3: designators end in _3; ports 3V3_3A=3V3_3A_3
ST1Sxx_4: designators end in _4; ports 3V3_3A=3V3_3A_4
ST1Sxx_5: designators end in _5; ports 3V3_3A=3V3_3A_5
ST1Sxx_6: designators end in _6; ports 3V3_3A=3V3_3A_6
ST1Sxx_7: designators end in _7; ports 3V3_3A=3V3_3A_7
ST1Sxx_8: designators end in _8; ports 3V3_3A=3V3_3A_8

### Library data of the parts
C113 = C0805: Chip Capacitor 0805; Assembly: 10u_X7R_50V_10%_0805; Voltage_assembly: 50V; Voltage: 50В; Tolerance: 10%; TemperatureCoeff: X7R; Family: Конденсатор SMD; Package: 0805; Capacitance: 10мкФ
C114 = C0805: Chip Capacitor 0805; Assembly: 4.7u_X7R_50V_10%_0805; Voltage_assembly: 50V; Voltage: 50В; Tolerance: 10%; TemperatureCoeff: X7R; Family: Конденсатор SMD; Package: 0805; Capacitance: 4.7мкФ
C115 = C0402: Chip Capacitor 0402; Capacitance: 4700пФ; Assembly: 4700p_X7R_25V_10%_0402; Voltage_assembly: 25V; Voltage: 6.3В; Tolerance: 10%; TemperatureCoeff: X7R; Family: Конденсатор SMD; Package: 0402
C116 C117 = C0603: Chip Capacitor 0603; Voltage_assembly: 25V; Assembly: 22u_X7R_25V_10%_0603; Voltage: 6.3В; Tolerance: 10%; TemperatureCoeff: X7R; Family: Конденсатор SMD; Package: 0603; Capacitance: 22мкФ
C118 = C0603: Chip Capacitor 0603; Voltage_assembly: 25V; Assembly: 0.1u_X7R_25V_10%_0603; Voltage: 6.3В; Tolerance: 10%; TemperatureCoeff: X7R; Family: Конденсатор SMD; Package: 0603; Capacitance: 0.1мкФ
L11 = SRP4020TA: Shielded Power Inductor; Manufacturer: Bourns Inc.; PartNumber: SRP4020TA-3R3M; Inductance: 3.3мкГн; Family: Катушка индуктивности; Assembly: SRP4020TA-3R3M
R62 = R0402_0.063: Chip Resistor 0402, 0.063 W; Assembly: 62k_0.063W_1%_0402; Power_assembly: 0.063W; Power: 0.063Вт; Tolerance: 1%; Family: Резистор SMD; Package: 0402; Resistance: 62кОм
R63 = R0402_0.063: Chip Resistor 0402, 0.063 W; Assembly: 20k_0.063W_1%_0402; Power_assembly: 0.063W; Power: 0.063Вт; Tolerance: 1%; Family: Резистор SMD; Package: 0402; Resistance: 20кОм
U23 = ST1S10PHR: 3 A, 900 kHz, monolithic synchronous step-down regulator IC; Manufacturer: STMicroelectronics; Family: Микросхема; Package: VFQFPN; Assembly: ST1S40IPUR

## Sheet Sheet1_1.SchDoc
size 431 x 279 mm; Organization: ORGANIZATION; Address1: ADDRESS 1; Address2: ADDRESS 2; Address3: ADDRESS 3; Address4: ADDRESS 4; Revision: -; ENG_APP_DATE: --/--/--; DSN_APP_DATE: --/--/--; CHK_APP_DATE: --/--/--
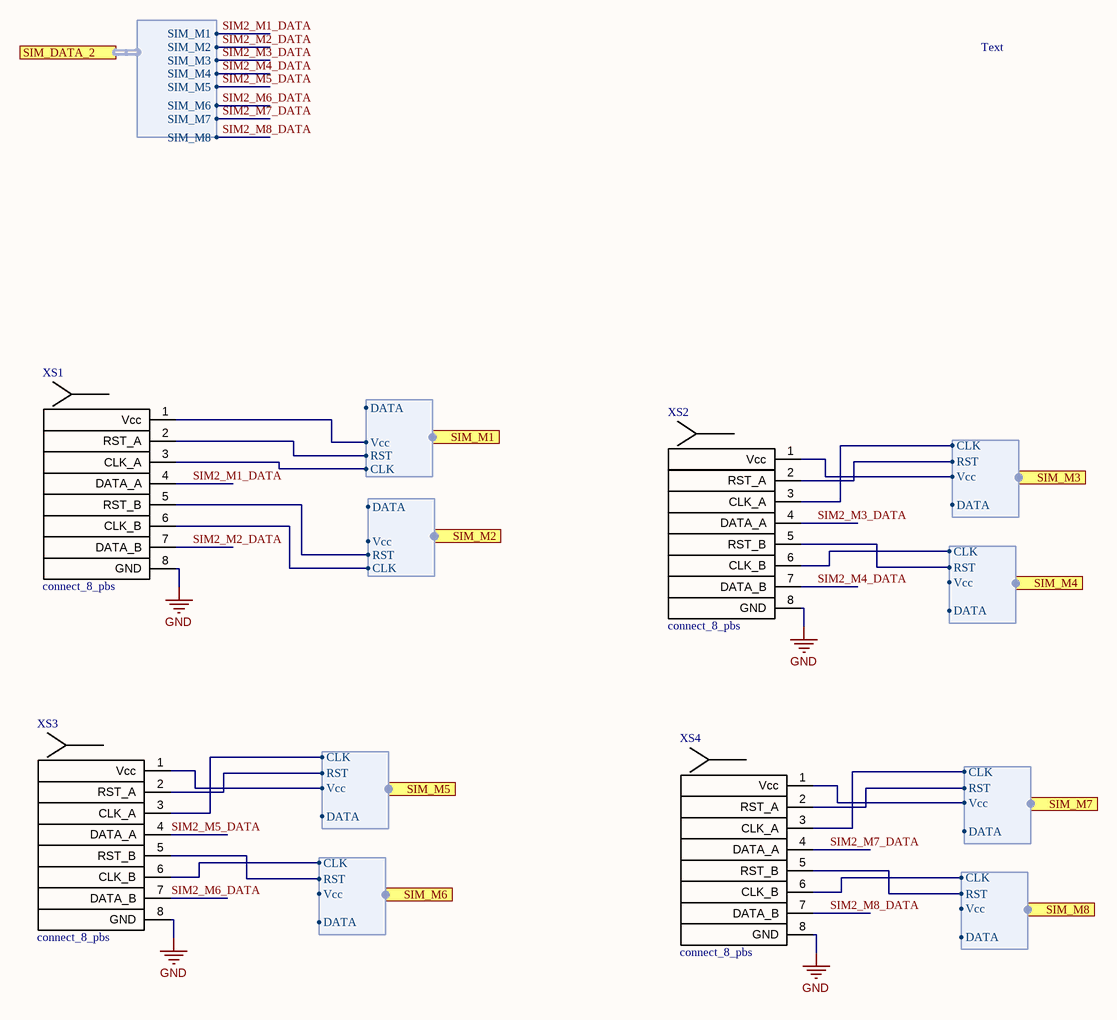
[diagram p11: Sheet1_1.SchDoc]

### Parts
XS1  connect_8_pbs  [PBS_8]
XS2  connect_8_pbs  [PBS_8]
XS3  connect_8_pbs  [PBS_8]
XS4  connect_8_pbs  [PBS_8]

### Ports
SIM_DATA_2 (harness SIM_DATA_2), SIM_M1 (harness SIM), SIM_M2 (harness SIM), SIM_M3 (harness SIM), SIM_M4 (harness SIM), SIM_M5 (harness SIM), SIM_M6 (harness SIM), SIM_M7 (harness SIM), SIM_M8 (harness SIM)

### Harnesses
SIM_DATA_2: SIM_M1, SIM_M2, SIM_M3, SIM_M4, SIM_M5, SIM_M6, SIM_M7, SIM_M8
SIM: Vcc, RST, CLK, DATA

### Nets
GND: XS1.8(GND) XS2.8(GND) XS3.8(GND) XS4.8(GND)
SIM2_M1_DATA: XS1.4(DATA_A) ; port SIM_DATA_2.SIM_M1
SIM2_M2_DATA: XS1.7(DATA_B) ; port SIM_DATA_2.SIM_M2
SIM2_M3_DATA: XS2.4(DATA_A) ; port SIM_DATA_2.SIM_M3
SIM2_M4_DATA: XS2.7(DATA_B) ; port SIM_DATA_2.SIM_M4
SIM2_M5_DATA: XS3.4(DATA_A) ; port SIM_DATA_2.SIM_M5
SIM2_M6_DATA: XS3.7(DATA_B) ; port SIM_DATA_2.SIM_M6
SIM2_M7_DATA: XS4.4(DATA_A) ; port SIM_DATA_2.SIM_M7
SIM2_M8_DATA: XS4.7(DATA_B) ; port SIM_DATA_2.SIM_M8
SIM_M1.CLK: XS1.3(CLK_A) ; port SIM_M1.CLK
SIM_M1.RST: XS1.2(RST_A) ; port SIM_M1.RST
SIM_M1.Vcc: XS1.1(Vcc) ; port SIM_M1.Vcc
SIM_M2.CLK: XS1.6(CLK_B) ; port SIM_M2.CLK
SIM_M2.RST: XS1.5(RST_B) ; port SIM_M2.RST
SIM_M3.CLK: XS2.3(CLK_A) ; port SIM_M3.CLK
SIM_M3.RST: XS2.2(RST_A) ; port SIM_M3.RST
SIM_M3.Vcc: XS2.1(Vcc) ; port SIM_M3.Vcc
SIM_M4.CLK: XS2.6(CLK_B) ; port SIM_M4.CLK
SIM_M4.RST: XS2.5(RST_B) ; port SIM_M4.RST
SIM_M5.CLK: XS3.3(CLK_A) ; port SIM_M5.CLK
SIM_M5.RST: XS3.2(RST_A) ; port SIM_M5.RST
SIM_M5.Vcc: XS3.1(Vcc) ; port SIM_M5.Vcc
SIM_M6.CLK: XS3.6(CLK_B) ; port SIM_M6.CLK
SIM_M6.RST: XS3.5(RST_B) ; port SIM_M6.RST
SIM_M7.CLK: XS4.3(CLK_A) ; port SIM_M7.CLK
SIM_M7.RST: XS4.2(RST_A) ; port SIM_M7.RST
SIM_M7.Vcc: XS4.1(Vcc) ; port SIM_M7.Vcc
SIM_M8.CLK: XS4.6(CLK_B) ; port SIM_M8.CLK
SIM_M8.RST: XS4.5(RST_B) ; port SIM_M8.RST

### Notes on the sheet
- Text
- DWG. NO.
- REV.
- SHT.
- THIS DOCUMENT AND THE DATA DISCLOSED HEREIN OR HEREWITH IS THE PROPERTY OF ALTIUM LIMITED AND MAY BE FREELY DISTRIBUTED IN WHOLE. NO RIGHTS ARE RESERVED OR EXPRESS OR IMPLIED WARANTEE GIVEN.
- REVISION
- DESCRIPTION
- DATE
- APPROVED
- ENG:
- APPROVALS
- PROJECT
- DSN:
- CHK:
- REFERENCE DOCUMENTS
- PROJECT REVISION:
- TITLE
- DOCUMENT REVISION:
- DESIGN ITEM:
- BOM:
- FAB DWG:
- PCB DWG:
- ASSY DWG:
- SCALE:
- SIZE
- B
- CAGE CODE
- FILE NAME
- DWG NO.
- SHEET
- OF
- REV

### Library data of the parts
XS1-XS4 = connect_8_pbs: PBS-8 (DS-1023 -1x 8); ManufacturerName: Connfly; System: Connector; Assembly: PBS-8 (DS-1023 -1x 8); PartNumber: PBS-8 (DS-1023 -1x 8)

## Nets that join several sheets
GND: SIM_slots_1 (56 pins), Modems_1 (88 pins), USB2514_hubs (31 pins), Power_and_connector (J9.2 J10.3 Q10.2 R18.2), USB2514_hubs_1 (31 pins), 1 (C1_1.2 C2_1.2 U1_1.1), 2 (C1_2.2 C2_2.2 U1_2.1), Arduino_CTRL (A1.Minus C111.2 C112.2 U22.1), Multiplexers (21 pins), ST1Sxx_1 (10 pins), ST1Sxx_2 (10 pins), ST1Sxx_3 (10 pins), ST1Sxx_4 (10 pins), ST1Sxx_5 (10 pins), ST1Sxx_6 (10 pins), ST1Sxx_7 (10 pins), ST1Sxx_8 (10 pins), Sheet1_1 (XS1.8 XS2.8 XS3.8 XS4.8)
VCC_5V: Arduino_CTRL (A1.VCC C112.1 U22.2 U22.4), Multiplexers (28 pins)
VCC_12V: Power_and_connector (Q9.3), 1 (C1_1.1 U1_1.3), 2 (C1_2.1 U1_2.3), Arduino_CTRL (C111.1 U22.3), ST1Sxx_1 (5 pins), ST1Sxx_2 (5 pins), ST1Sxx_3 (5 pins), ST1Sxx_4 (5 pins), ST1Sxx_5 (5 pins), ST1Sxx_6 (5 pins), ST1Sxx_7 (5 pins), ST1Sxx_8 (5 pins)
3V3_1: USB2514_hubs (14 pins), 1 (C2_1.1 U1_1.2 U1_1.4)
3V3_2: USB2514_hubs_1 (14 pins), 2 (C2_2.1 U1_2.2 U1_2.4)
3V3_3A_1: Modems_1 (F3.1), ST1Sxx_1 (6 pins)
3V3_3A_2: Modems_1 (F4.1), ST1Sxx_2 (6 pins)
3V3_3A_3: Modems_1 (F7.1), ST1Sxx_3 (6 pins)
3V3_3A_4: Modems_1 (F1.1), ST1Sxx_4 (6 pins)
3V3_3A_5: Modems_1 (F5.1), ST1Sxx_5 (6 pins)
3V3_3A_6: Modems_1 (F8.1), ST1Sxx_6 (6 pins)
3V3_3A_7: Modems_1 (F2.1), ST1Sxx_7 (6 pins)
3V3_3A_8: Modems_1 (F6.1), ST1Sxx_8 (6 pins)
EN_M1: Modems_1 (R4.1 U2.1 U2.4 U2.10), Arduino_CTRL (A1.2)
EN_M2: Modems_1 (R10.1 U5.1 U5.4 U5.10), Arduino_CTRL (A1.3)
EN_M3: Modems_1 (R15.1 U8.1 U8.4 U8.10), Arduino_CTRL (A1.4)
EN_M4: Modems_1 (R5.1 U3.1 U3.4 U3.10), Arduino_CTRL (A1.5)
EN_M5: Modems_1 (R11.1 U6.1 U6.4 U6.10), Arduino_CTRL (A1.6)
EN_M6: Modems_1 (R16.1 U9.1 U9.4 U9.10), Arduino_CTRL (A1.7)
EN_M7: Modems_1 (R6.1 U4.1 U4.4 U4.10), Arduino_CTRL (A1.8)
EN_M8: Modems_1 (R12.1 U7.1 U7.4 U7.10), Arduino_CTRL (A1.9)
SD_M1: Modems_1 (J1.10), Multiplexers (U13.1)
SD_M2: Modems_1 (J4.10), Multiplexers (U13.3)
SD_M3: Modems_1 (J7.10), Multiplexers (U13.8)
SD_M4: Modems_1 (J2.10), Multiplexers (U13.11)
SD_M5: Modems_1 (J5.10), Multiplexers (U12.1)
SD_M6: Modems_1 (J8.10), Multiplexers (U12.3)
SD_M7: Modems_1 (J3.10), Multiplexers (U12.8)
SD_M8: Modems_1 (J6.10), Multiplexers (U12.11)
SIM1_M1_DATA: SIM_slots_1 (C54.2 J11.6 VD10.1 VD10.2), Multiplexers (U14.3)
SIM1_M2_DATA: SIM_slots_1 (C60.2 J14.6 VD17.1 VD17.2), Multiplexers (U16.3)
SIM1_M3_DATA: SIM_slots_1 (C65.2 J17.6 VD22.1 VD22.2), Multiplexers (U19.3)
SIM1_M4_DATA: SIM_slots_1 (C55.2 J12.6 VD12.1 VD12.2), Multiplexers (U21.3)
SIM1_M5_DATA: SIM_slots_1 (C61.2 J15.6 VD18.1 VD18.2), Multiplexers (U15.3)
SIM1_M6_DATA: SIM_slots_1 (C66.2 J18.6 VD24.1 VD24.2), Multiplexers (U17.3)
SIM1_M7_DATA: SIM_slots_1 (C56.2 J13.6 VD14.1 VD14.2), Multiplexers (U18.3)
SIM1_M8_DATA: SIM_slots_1 (C62.2 J16.6 VD20.1 VD20.2), Multiplexers (U20.3)
SIM2_M1_DATA: Multiplexers (U14.1), Sheet1_1 (XS1.4)
SIM2_M2_DATA: Multiplexers (U16.1), Sheet1_1 (XS1.7)
SIM2_M3_DATA: Multiplexers (U19.1), Sheet1_1 (XS2.4)
SIM2_M4_DATA: Multiplexers (U21.1), Sheet1_1 (XS2.7)
SIM2_M5_DATA: Multiplexers (U15.1), Sheet1_1 (XS3.4)
SIM2_M6_DATA: Multiplexers (U17.1), Sheet1_1 (XS3.7)
SIM2_M7_DATA: Multiplexers (U18.1), Sheet1_1 (XS4.4)
SIM2_M8_DATA: Multiplexers (U20.1), Sheet1_1 (XS4.7)
SIM_M1.CLK: SIM_slots_1 (J11.3 VD9.2), Modems_1 (J1.12), Sheet1_1 (XS1.3)
SIM_M1.RST: SIM_slots_1 (J11.2 VD9.1), Modems_1 (J1.14), Sheet1_1 (XS1.2)
SIM_M1.Vcc: SIM_slots_1 (C51.1 J11.1), Modems_1 (J1.8), Sheet1_1 (XS1.1)
SIM_M1_S: Arduino_CTRL (A1.A3), Multiplexers (R54.1 U14.6)
SIM_M2.CLK: SIM_slots_1 (J14.3 VD15.2), Modems_1 (J4.12), Sheet1_1 (XS1.6)
SIM_M2.RST: SIM_slots_1 (J14.2 VD15.1), Modems_1 (J4.14), Sheet1_1 (XS1.5)
SIM_M2.Vcc: SIM_slots_1 (C57.1 J14.1), Modems_1 (J4.8)
SIM_M2_S: Arduino_CTRL (A1.A2), Multiplexers (R56.1 U16.6)
SIM_M3.CLK: SIM_slots_1 (J17.3 VD21.2), Modems_1 (J7.12), Sheet1_1 (XS2.3)
SIM_M3.RST: SIM_slots_1 (J17.2 VD21.1), Modems_1 (J7.14), Sheet1_1 (XS2.2)
SIM_M3.Vcc: SIM_slots_1 (C63.1 J17.1), Modems_1 (J7.8), Sheet1_1 (XS2.1)
SIM_M3_S: Arduino_CTRL (A1.A1), Multiplexers (R59.1 U19.6)
SIM_M4.CLK: SIM_slots_1 (J12.3 VD11.2), Modems_1 (J2.12), Sheet1_1 (XS2.6)
SIM_M4.RST: SIM_slots_1 (J12.2 VD11.1), Modems_1 (J2.14), Sheet1_1 (XS2.5)
SIM_M4.Vcc: SIM_slots_1 (C52.1 J12.1), Modems_1 (J2.8)
SIM_M4_S: Arduino_CTRL (A1.A0), Multiplexers (R61.1 U21.6)
SIM_M5.CLK: SIM_slots_1 (J15.3 VD16.2), Modems_1 (J5.12), Sheet1_1 (XS3.3)
SIM_M5.RST: SIM_slots_1 (J15.2 VD16.1), Modems_1 (J5.14), Sheet1_1 (XS3.2)
SIM_M5.Vcc: SIM_slots_1 (C58.1 J15.1), Modems_1 (J5.8), Sheet1_1 (XS3.1)
SIM_M5_S: Arduino_CTRL (A1.13), Multiplexers (R55.1 U15.6)
SIM_M6.CLK: SIM_slots_1 (J18.3 VD23.2), Modems_1 (J8.12), Sheet1_1 (XS3.6)
SIM_M6.RST: SIM_slots_1 (J18.2 VD23.1), Modems_1 (J8.14), Sheet1_1 (XS3.5)
SIM_M6.Vcc: SIM_slots_1 (C64.1 J18.1), Modems_1 (J8.8)
SIM_M6_S: Arduino_CTRL (A1.12), Multiplexers (R57.1 U17.6)
SIM_M7.CLK: SIM_slots_1 (J13.3 VD13.2), Modems_1 (J3.12), Sheet1_1 (XS4.3)
SIM_M7.RST: SIM_slots_1 (J13.2 VD13.1), Modems_1 (J3.14), Sheet1_1 (XS4.2)
SIM_M7.Vcc: SIM_slots_1 (C53.1 J13.1), Modems_1 (J3.8), Sheet1_1 (XS4.1)
SIM_M7_S: Arduino_CTRL (A1.11), Multiplexers (R58.1 U18.6)
SIM_M8.CLK: SIM_slots_1 (J16.3 VD19.2), Modems_1 (J6.12), Sheet1_1 (XS4.6)
SIM_M8.RST: SIM_slots_1 (J16.2 VD19.1), Modems_1 (J6.14), Sheet1_1 (XS4.5)
SIM_M8.Vcc: SIM_slots_1 (C59.1 J16.1), Modems_1 (J6.8)
SIM_M8_S: Arduino_CTRL (A1.10), Multiplexers (R60.1 U20.6)
SIM_ON: Power_and_connector (J10.1), Multiplexers (9 pins)
USB_M1._N: Modems_1 (L1.3), USB2514_hubs (U10.1)
USB_M1._P: Modems_1 (L1.2), USB2514_hubs (U10.2)
USB_M2._N: Modems_1 (L4.3), USB2514_hubs (U10.3)
USB_M2._P: Modems_1 (L4.2), USB2514_hubs (U10.4)
USB_M3._N: Modems_1 (L7.3), USB2514_hubs (U10.6)
USB_M3._P: Modems_1 (L7.2), USB2514_hubs (U10.7)
USB_M4._N: Modems_1 (L2.3), USB2514_hubs (U10.8)
USB_M4._P: Modems_1 (L2.2), USB2514_hubs (U10.9)
USB_M5._N: Modems_1 (L5.3), USB2514_hubs_1 (U11.1)
USB_M5._P: Modems_1 (L5.2), USB2514_hubs_1 (U11.2)
USB_M6._N: Modems_1 (L8.3), USB2514_hubs_1 (U11.3)
USB_M6._P: Modems_1 (L8.2), USB2514_hubs_1 (U11.4)
USB_M7._N: Modems_1 (L3.3), USB2514_hubs_1 (U11.6)
USB_M7._P: Modems_1 (L3.2), USB2514_hubs_1 (U11.7)
USB_M8._N: Modems_1 (L6.3), USB2514_hubs_1 (U11.8)
USB_M8._P: Modems_1 (L6.2), USB2514_hubs_1 (U11.9)